# Altium schematic sheet QCopterFC_KEY_Sch.SchDoc
size A4
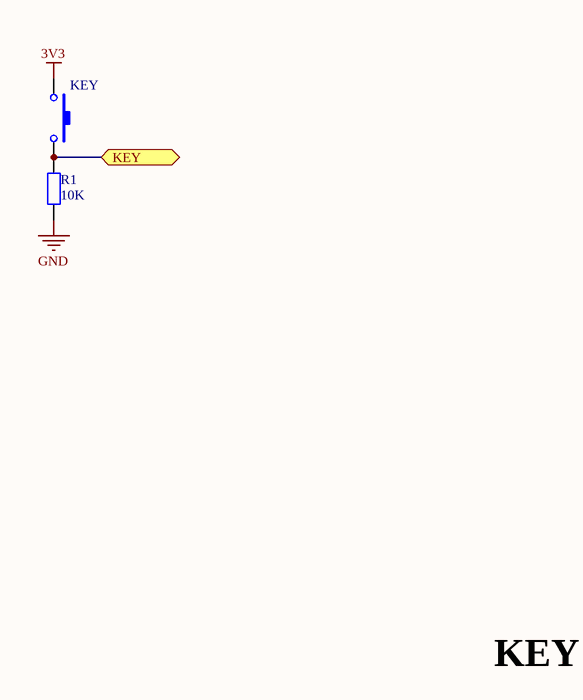
[diagram p0: QCopterFC_KEY_Sch.SchDoc]

## Parts
KEY  SW-PB_1  [BT_90_T]  (value not drawn)
R1  value 10K  [RES_0603]  (hidden comment: Res_0603)

## Ports
KEY

## Nets
3V3: KEY.1
GND: R1.1
KEY: KEY.2 R1.2 ; port KEY

## Notes on the sheet
- KEY

## Library data of the parts
KEY = SW-PB_1: Switch; Published: 24-Mar-1999; LatestRevisionDate: 17-Jul-2002; LatestRevisionNote: Re-released for DXP Platform.; PackageReference: SPST-2; Publisher: Altium Limited; PackageDescription: Switch; 2 Leads
R1 = Res_0603: Resistor